# Altium schematic sheet PORT.SchDoc
size A4; SheetNumber: 1; SheetTotal: 5
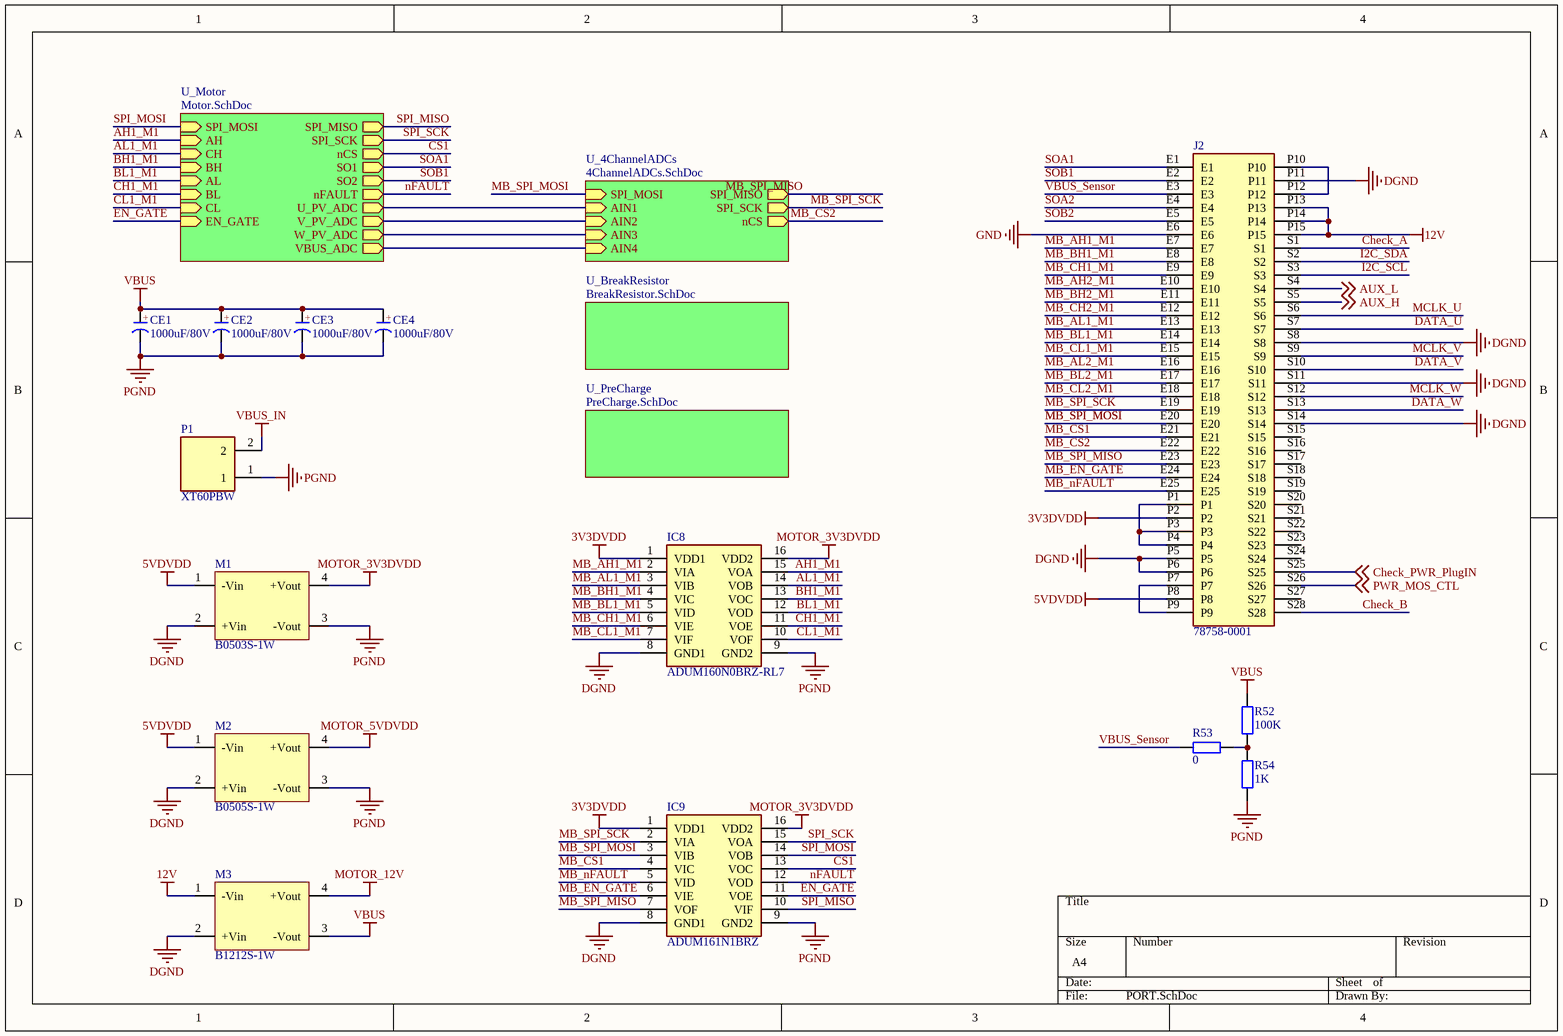
[diagram p0: PORT.SchDoc]

## Parts
CE1  1000uF/80V  [CAP 7.5*18*35.5 - BK]
CE2  1000uF/80V  [CAP 7.5*18*35.5 - BK]
CE3  1000uF/80V  [CAP 7.5*18*35.5 - BK]
CE4  1000uF/80V  [CAP 7.5*18*35.5 - BK]
IC8  ADUM160N0BRZ-RL7  [SOIC127P600X175-16N]
IC9  ADUM161N1BRZ  [SOIC127P600X175-16N]
J2  78758-0001  [78758-0001]
M1  B0503S-1W  [B0505S-1W]
M2  B0505S-1W  [B0505S-1W]
M3  B1212S-1W  [B0505S-1W]
P1  XT60PBW  [XT60]
R52  100K  [R 0603_L]
R53  0  [R 0603_L]
R54  1K  [R 0603_L]

## Sub-sheets
U_4ChannelADCs = 4ChannelADCs.SchDoc: SPI_MOSI (in), SPI_MISO (out), SPI_SCK (out), nCS (out), AIN1 (in), AIN2 (in), AIN3 (in), AIN4 (in)
U_BreakResistor = BreakResistor.SchDoc: no entries
U_Motor = Motor.SchDoc: SPI_MOSI (in), SPI_MISO (out), SPI_SCK (out), AH (in), CH (in), BH (in), AL (in), BL (in), CL (in), nCS (out), SO1 (out), SO2 (out), EN_GATE (in), nFAULT (out), U_PV_ADC (out), V_PV_ADC (out), W_PV_ADC (out), VBUS_ADC (out)
U_PreCharge = PreCharge.SchDoc: no entries

## Nets
3V3DVDD: IC8.1(VDD1) IC9.1(VDD1) J2.P2
5VDVDD: J2.P8 M1.1(-Vin) M2.1(-Vin)
12V: J2.P13 J2.P14 J2.P15 M3.1(-Vin)
DGND: IC8.8(GND1) IC9.8(GND1) J2.P5 J2.P6 J2.P11 J2.S8 J2.S11 J2.S14 M1.2(+Vin) M2.2(+Vin) M3.2(+Vin)
GND: J2.E6
MOTOR_3V3DVDD: IC8.16(VDD2) IC9.16(VDD2) M1.4(+Vout)
MOTOR_5VDVDD: M2.4(+Vout)
MOTOR_12V: M3.4(+Vout)
PGND: CE1.2(K) CE2.2(K) CE3.2(K) CE4.2(K) IC8.9(GND2) IC9.9(GND2) M1.3(-Vout) M2.3(-Vout) P1.1 R54.1
VBUS: CE1.1(A) CE2.1(A) CE3.1(A) CE4.1(A) M3.3(-Vout) R52.2
VBUS_IN: P1.2
AH1_M1: IC8.15(VOA) ; sheet U_Motor/AH
AL1_M1: IC8.14(VOB) ; sheet U_Motor/CH
AUX_H: J2.S5 ; off-sheet AUX_H
AUX_L: J2.S4 ; off-sheet AUX_L
BH1_M1: IC8.13(VOC) ; sheet U_Motor/BH
BL1_M1: IC8.12(VOD) ; sheet U_Motor/AL
CH1_M1: IC8.11(VOE) ; sheet U_Motor/BL
Check_A: J2.S1
Check_B: J2.S28
Check_PWR_PlugIN: J2.S25 ; off-sheet Check_PWR_PlugIN
CL1_M1: IC8.10(VOF) ; sheet U_Motor/CL
CS1: IC9.13(VOC) ; sheet U_Motor/nCS
DATA_U: J2.S7
DATA_V: J2.S10
DATA_W: J2.S13
EN_GATE: IC9.11(VOE) ; sheet U_Motor/EN_GATE
I2C_SCL: J2.S3
I2C_SDA: J2.S2
MB_AH1_M1: IC8.2(VIA) J2.E7
MB_AH2_M1: J2.E10
MB_AL1_M1: IC8.3(VIB) J2.E13
MB_AL2_M1: J2.E16
MB_BH1_M1: IC8.4(VIC) J2.E8
MB_BH2_M1: J2.E11
MB_BL1_M1: IC8.5(VID) J2.E14
MB_BL2_M1: J2.E17
MB_CH1_M1: IC8.6(VIE) J2.E9
MB_CH2_M1: J2.E12
MB_CL1_M1: IC8.7(VIF) J2.E15
MB_CL2_M1: J2.E18
MB_CS1: IC9.4(VIC) J2.E21
MB_CS2: J2.E22 ; sheet U_4ChannelADCs/nCS
MB_EN_GATE: IC9.6(VIE) J2.E24
MB_nFAULT: IC9.5(VID) J2.E25
MB_SPI_MISO: IC9.7(VOF) J2.E23 ; sheet U_4ChannelADCs/SPI_MISO
MB_SPI_MOSI: IC9.3(VIB) J2.E20 ; sheet U_4ChannelADCs/SPI_MOSI
MB_SPI_SCK: IC9.2(VIA) J2.E19 ; sheet U_4ChannelADCs/SPI_SCK
MCLK_U: J2.S6
MCLK_V: J2.S9
MCLK_W: J2.S12
nFAULT: IC9.12(VOD) ; sheet U_Motor/nFAULT
PWR_MOS_CTL: J2.S26 ; off-sheet PWR_MOS_CTL
SOA1: J2.E1 ; sheet U_Motor/SO1
SOA2: J2.E4
SOB1: J2.E2 ; sheet U_Motor/SO2
SOB2: J2.E5
SPI_MISO: IC9.10(VIF) ; sheet U_Motor/SPI_MISO
SPI_MOSI: IC9.14(VOB) ; sheet U_Motor/SPI_MOSI
SPI_SCK: IC9.15(VOA) ; sheet U_Motor/SPI_SCK
VBUS_Sensor: J2.E3 R53.2
NetJ2_P1: J2.P1 J2.P3 J2.P4
NetJ2_P7: J2.P7 J2.P9
NetJ2_P10: J2.P10 J2.P12
NetR52_1: R52.1 R53.1 R54.2
(unnamed): sheet U_Motor/U_PV_ADC, sheet U_4ChannelADCs/AIN1
(unnamed): sheet U_Motor/V_PV_ADC, sheet U_4ChannelADCs/AIN2
(unnamed): sheet U_Motor/W_PV_ADC, sheet U_4ChannelADCs/AIN3
(unnamed): sheet U_Motor/VBUS_ADC, sheet U_4ChannelADCs/AIN4

Not connected (* = marked no-connect by the designer): J2 S15 S16 S17 S18 S19 S20 S21 S22 S23 S24 S27

## Notes on the sheet
- (in symbol CE) +

## Library data of the parts
CE1-CE4 = CE: 直插电解电容
IC8 = ADUM160N0BRZ-RL7: Integrated Circuit; Manufacturer_Name: Analog Devices; Datasheet Link: https://www.analog.com/media/en/technical-documentation/data-sheets/adum160n-161n-162n-163n.pdf; Height: 1.75mm; Manufacturer_Part_Number: ADUM160N0BRZ-RL7; Mouser Part Number: 584-ADUM160N0BRZ-RL7; Mouser Price/Stock: https://www.mouser.co.uk/ProductDetail/Analog-Devices/ADUM160N0BRZ-RL7?qs=cslStgdnz9OW1mXsMBZKfA%3D%3D; Arrow Part Number: ADUM160N0BRZ-RL7; Arrow Price/Stock: https://www.arrow.com/en/products/adum160n0brz-rl7/analog-devices
IC9 = ADUM161N1BRZ: Integrated Circuit; Manufacturer_Name: Analog Devices; Datasheet Link: https://componentsearchengine.com/Datasheets/1/ADUM161N1BRZ.pdf; Height: 1.75mm; Manufacturer_Part_Number: ADUM161N1BRZ; Mouser Part Number: 584-ADUM161N1BRZ; Mouser Price/Stock: https://www.mouser.co.uk/ProductDetail/Analog-Devices/ADUM161N1BRZ?qs=cslStgdnz9PXnDzAofgUAA%3D%3D; Arrow Part Number: ADUM161N1BRZ; Arrow Price/Stock: https://www.arrow.com/en/products/adum161n1brz/analog-devices
J2 = 78758-0001: Connector; Manufacturer_Name: Molex; Manufacturer_Part_Number: 78758-0001; Mouser Part Number: 538-78758-0001; Mouser Price/Stock: https://www.mouser.co.uk/ProductDetail/Molex/78758-0001?qs=wOSGPAwRNAFEK7d2ROR5rw%3D%3D
M1-M3 = B0505S-1W: DC-DC模块; 版权归属: 封装库来自淘宝 ID：黄晶宝石; BOM名称: DC-DC模块; 学习资源: https://shop463601444.taobao.com
R52-R54 = R: 贴片电阻; BOM名称: 贴片电阻